# Altium schematic sheet BNC-OUTPUT.V03.R00.SchDoc: Salida BNC 50 Ohm
size A4; SheetNumber: 13; SheetTotal: 18
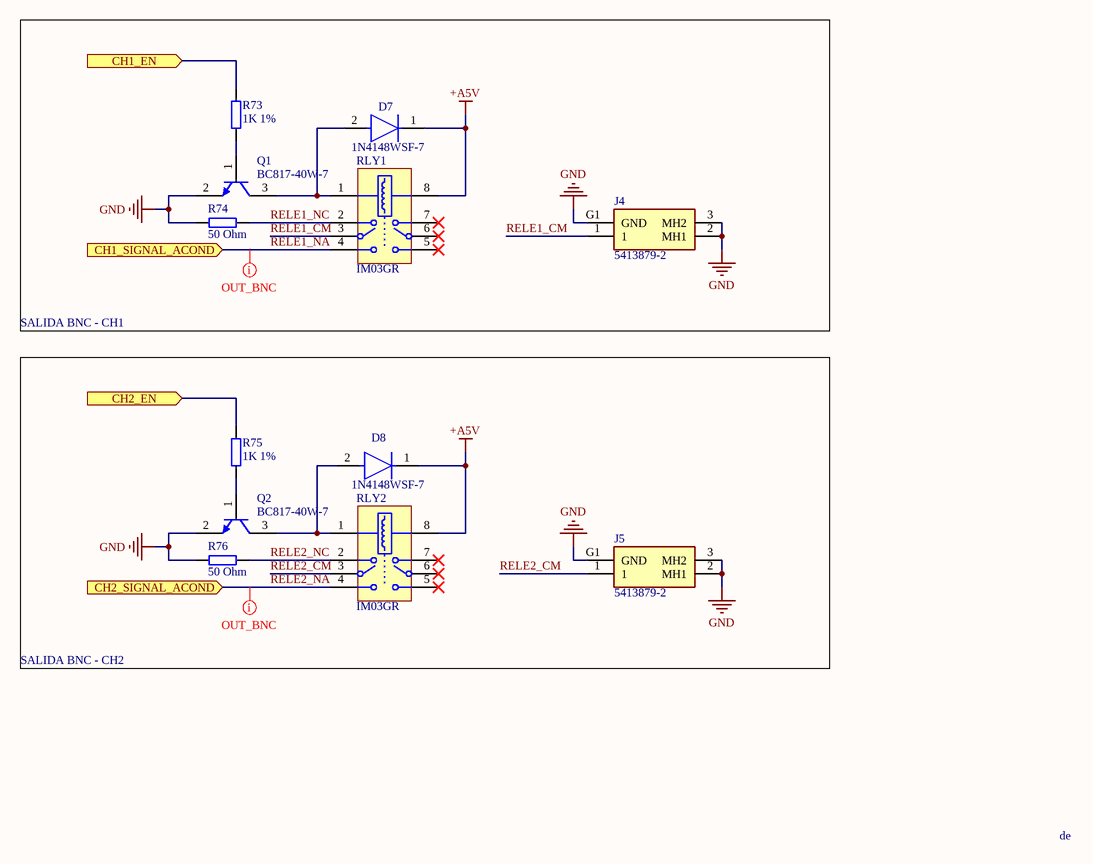
[diagram p0: BNC-OUTPUT.V03.R00.SchDoc]

## Parts
D7  1N4148WSF-7  [FP-SOD323F-MFG]
D8  1N4148WSF-7  [FP-SOD323F-MFG]
J4  5413879-2  [54138792]
J5  5413879-2  [54138792]
Q1  BC817-40W-7  [DIOD-SOT323-3_V]
Q2  BC817-40W-7  [DIOD-SOT323-3_V]
R73  1K 1%  [RES_0805]
R74  50 Ohm  [RES_0805]
R75  1K 1%  [RES_0805]
R76  50 Ohm  [RES_0805]
RLY1  IM03GR  [TECO-IM-8G-WING]
RLY2  IM03GR  [TECO-IM-8G-WING]

## Blocks framed on the sheet
SALIDA BNC - CH1: D7 J4 Q1 R73 R74 RLY1
SALIDA BNC - CH2: D8 J5 Q2 R75 R76 RLY2

## Ports
CH1_EN (in), CH1_SIGNAL_ACOND (in), CH2_EN (in), CH2_SIGNAL_ACOND (in)

## Nets
+A5V: D7.1(C) D8.1(C) RLY1.8 RLY2.8
GND: J4.2(MH1) J4.3(MH2) J4.G1(GND) J5.2(MH1) J5.3(MH2) J5.G1(GND) Q1.2(E) Q2.2(E) R74.1 R76.1
CH1_EN: R73.2 ; port CH1_EN
CH2_EN: R75.2 ; port CH2_EN
RELE1_CM: J4.1 RLY1.3
RELE1_NA: RLY1.4 ; port CH1_SIGNAL_ACOND
RELE1_NC: R74.2 RLY1.2
RELE2_CM: J5.1 RLY2.3
RELE2_NA: RLY2.4 ; port CH2_SIGNAL_ACOND
RELE2_NC: R76.2 RLY2.2
NetD7_2: D7.2(A) Q1.3(C) RLY1.1
NetD8_2: D8.2(A) Q2.3(C) RLY2.1
NetQ1_1: Q1.1(B) R73.1
NetQ2_1: Q2.1(B) R75.1

Not connected (* = marked no-connect by the designer): RLY1 5* 6* 7*; RLY2 5* 6* 7*

## Layout directives
net class OUT_BNC; rule Width Constraint [Pref Impedance = 50.00ohms    Min Impedance = 50.00ohms    Max Impedance = 50.00ohms]; rule Routing Via Style [Pref Size = 0.6mm    Pref Hole Size = 0.3mm]: RELE1_NA, RELE2_NA

## Notes on the sheet
- de

## Library data of the parts
D7 D8 = CMP-12791-000029-1: DIODE GEN PURP 100V 250MA SOD323; Manufacturer: Diodes Inc.; Value: 1.5pF; Max Surge Forward Current: 0.5A; Peak Reverse Current: 0.5uA; Max Junction Temp: +150°C; Height: 0.75mm; Digikey Description: DIODE GEN PURP 100V 250MA SOD323; Automotive: No; Footprint Url: https://www.diodes.com/assets/Package-Files/SOD323F.pdf; Category: Diode; Manufacturer Part Number: 1N4148WSF-7; Max Repetitive Reverse Voltage: 100V; Lead Free: Yes; Temperature Range High: +150°C; Forward Current: 250mA; Reverse Voltage: 100V; Device Class L3: Rectifier Diodes; ComponentLink2URL: https://www.diodes.com/assets/Datasheets/1N4148WSF.pdf; Package: SOD323F; RoHS: TRUE; Mouser Description: Diodes - General Purpose, Power, Switching 200mW 2pF 75Vrrm 150mA 2A 1VF; Temperature: -55°C to +150°C; Capacitance: 1.5pF; Device Class L2: Diodes; ComponentLink2Description: Datasheet; Device Class L1: Discrete Semiconductors; Octopart: https://octopart.com/1n4148wsf-7-diodes+inc.-33798544; Temperature Range Low: -55°C
J4 J5 = 5413879-2: BNC RF Interface, Jack, 50 ohm, Bayonet, 4 GHz Operating Frequency, Cable-to-Board, 1 Position, Printed Circuit Board, Board Mount / Panel Mount; Manufacturer_Name: TE Connectivity; Geometry.Height: 12.95mm; Mouser Part Number: 571-5413879-2; Mouser Price/Stock: https://www.mouser.co.uk/ProductDetail/TE-Connectivity/5413879-2?qs=dJbzCyn%252BCFbDLsMjA0NFtQ%3D%3D; Manufacturer_Part_Number: 5413879-2; Datasheet Link: https://www.te.com/commerce/DocumentDelivery/DDEController?Action=srchrtrv&DocNm=5413879&DocType=Customer%20Drawing&DocLang=English&PartCntxt=5413879-2&DocFormat=pdf
Q1 Q2 = CMP-2000-05934-1: NPN Small Signal Transistor, 45 V, 500 mA, -65 to 150 degC, 3-Pin SOT323, RoHS, Tape and Reel; Manufacturer: DiodesIncorporated; Configuration: Single; Collector- Emitter Voltage VCEO Max: 45V; Emitter- Base Voltage VEBO: 5V; DC Collector/Base Gain hfe Min: 250; Collector-Emitter Saturation Voltage: 0.7V; Collector- Base Voltage VCBO: 50V; Maximum DC Collector Current: 1A; Pd - Power Dissipation: 200mW; Gain Bandwidth Product fT: 100MHz; Unit Weight: 0.000282oz; Series: BC817; Datasheet Version: Rev. 5-2, 01/2014; Datasheet URL: http://www.diodes.com/_files/datasheets/ds30575.pdf; Manufacturer URL: http://www.diodes.com/; Length: 2.2mm; Mounting Style: SMD/SMT; Maximum Operating Temperature: +150C; Package Description: 3-Pin Small Outline Transistor, Body 2 x 1.25 mm, Pitch 0.65 mm; Width: 1.35mm; RoHS: True; Minimum Operating Temperature: -65C; Brand: DiodesIncorporated; Product Category: BipolarTransistors-BJT; Height: 1mm; Factory Pack Quantity: 3000; Package / Case: SOT-23; Packaging: Reel; Transistor Polarity: NPN; Mounting Technology: SurfaceMount; Package Reference: SOT323
R73-R76 = RES_0805: Resistor SMD 0805; Manufacturer: *; Manufacturer Part Number: *; Distributor Link: *; LCSC: *
RLY1 RLY2 = CMP-0439-00001-1: Low Power Consumption, High Dielectric, High Mechanical Shock Resistance, IM Relay; Manufacturer: TE Connectivity; Power Consumption: 140 mW; Contact Capacitance: 1 pF; Coil-contact Capacitance: 2 pF; Limiting Continuous Current: 2 A; ComponentLink1Description: Manufacturer URL; PackageReference: IM-8G-WING; Contact Material: PdRu +Au Covered; DatasheetVersion: Rev. 0411; ComponentLink2URL: http://www.te.com/commerce/DocumentDelivery/DDEController?Action=showdoc&DocId=Specification+Or+Standard%7F108-98001%7FS%7Fpdf%7FEnglish%7FENG_SS_108-98001_S.pdf%7F1-1462037-4; ComponentLink2Description: Datasheet; Mounting Technology: Surface Mount; Ambient Temperature: -40 to 85 degC; PartNumber: IM03GR; ComponentLink1URL: http://www.te.com/; PackageDescription: 8-Pin Relay, 10 x 6 mm Body, 0.95 mm Pitch